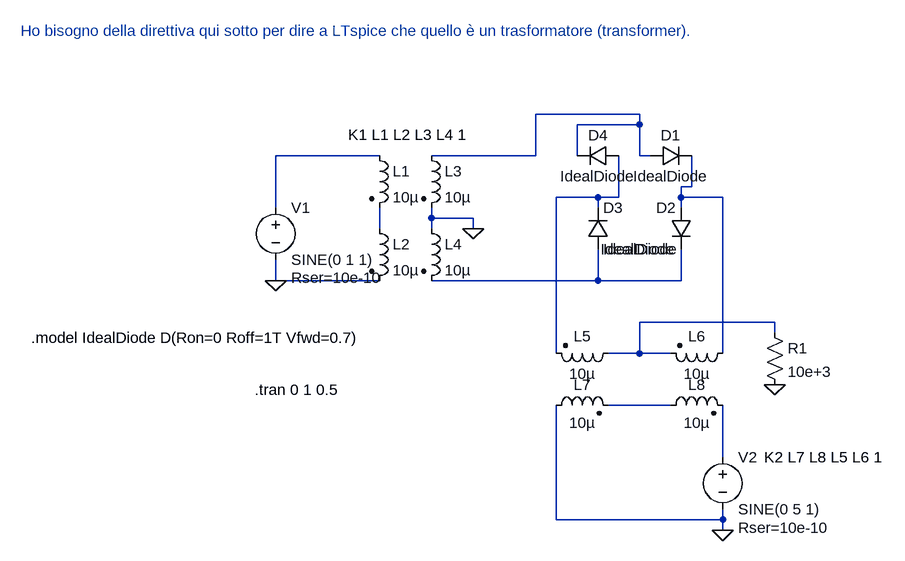
[diagram p0: schematic precision_rectifier - Copia.asc]
precision_rectifier - Copia.asc, the LTspice schematic file:
Version 4
SHEET 1 916 680
WIRE 528 -16 368 -16
WIRE 528 0 528 -16
WIRE 528 0 432 0
WIRE 128 48 -32 48
WIRE 368 48 368 -16
WIRE 368 48 208 48
WIRE 432 48 432 0
WIRE 528 48 528 0
WIRE 544 48 528 48
WIRE 608 96 608 48
WIRE 608 96 592 96
WIRE 464 112 400 112
WIRE 496 112 496 48
WIRE 496 112 464 112
WIRE 592 112 592 96
WIRE 656 112 592 112
WIRE -32 128 -32 48
WIRE 464 128 464 112
WIRE 592 128 592 112
WIRE 208 144 208 128
WIRE 272 144 208 144
WIRE 128 160 128 128
WIRE 208 160 208 144
WIRE 272 160 272 144
WIRE -32 240 -32 208
WIRE 128 240 -32 240
WIRE 464 240 464 192
WIRE 464 240 208 240
WIRE 592 240 592 192
WIRE 592 240 464 240
WIRE 736 304 528 304
WIRE 736 320 736 304
WIRE 400 352 400 112
WIRE 528 352 528 304
WIRE 528 352 480 352
WIRE 576 352 528 352
WIRE 656 352 656 112
WIRE 576 432 480 432
WIRE 656 512 656 432
WIRE 400 608 400 432
WIRE 656 608 656 592
WIRE 656 608 400 608
WIRE 656 624 656 608
FLAG 272 160 0
FLAG -32 240 0
FLAG 736 400 0
FLAG 656 624 0
SYMBOL voltage -32 112 R0
WINDOW 123 0 0 Left 0
WINDOW 39 24 124 Left 2
SYMATTR SpiceLine Rser=10e-10
SYMATTR InstName V1
SYMATTR Value SINE(0 1 1)
SYMBOL ind2 112 32 R0
SYMATTR InstName L1
SYMATTR Value 10µ
SYMATTR Type ind
SYMBOL ind2 112 144 R0
SYMATTR InstName L2
SYMATTR Value 10µ
SYMATTR Type ind
SYMBOL ind2 192 32 R0
SYMATTR InstName L3
SYMATTR Value 10µ
SYMATTR Type ind
SYMBOL ind2 192 144 R0
SYMATTR InstName L4
SYMATTR Value 10µ
SYMATTR Type ind
SYMBOL diode 544 32 M90
WINDOW 0 0 32 VBottom 2
WINDOW 3 32 32 VTop 2
SYMATTR InstName D1
SYMATTR Value IdealDiode
SYMBOL diode 608 128 M0
SYMATTR InstName D2
SYMATTR Value IdealDiode
SYMBOL diode 448 192 M180
WINDOW 0 24 64 Left 2
WINDOW 3 24 0 Left 2
SYMATTR InstName D3
SYMATTR Value IdealDiode
SYMBOL diode 496 64 M270
WINDOW 0 32 32 VTop 2
WINDOW 3 0 32 VBottom 2
SYMATTR InstName D4
SYMATTR Value IdealDiode
SYMBOL ind2 496 336 R90
WINDOW 0 5 56 VBottom 2
WINDOW 3 32 56 VTop 2
SYMATTR InstName L5
SYMATTR Value 10µ
SYMATTR Type ind
SYMBOL ind2 672 336 R90
WINDOW 0 5 56 VBottom 2
WINDOW 3 32 56 VTop 2
SYMATTR InstName L6
SYMATTR Value 10µ
SYMATTR Type ind
SYMBOL ind2 384 448 R270
WINDOW 0 32 56 VTop 2
WINDOW 3 5 56 VBottom 2
SYMATTR InstName L7
SYMATTR Value 10µ
SYMATTR Type ind
SYMBOL ind2 560 448 R270
WINDOW 0 32 56 VTop 2
WINDOW 3 5 56 VBottom 2
SYMATTR InstName L8
SYMATTR Value 10µ
SYMATTR Type ind
SYMBOL res 720 304 R0
SYMATTR InstName R1
SYMATTR Value 10e+3
SYMBOL voltage 656 496 R0
WINDOW 123 0 0 Left 0
WINDOW 39 24 124 Left 2
SYMATTR InstName V2
SYMATTR Value SINE(0 5 1)
SYMATTR SpiceLine Rser=10e-10
TEXT -64 408 Left 2 !.tran 0 1 0.5
TEXT -408 328 Left 2 !.model IdealDiode D(Ron=0 Roff=1T Vfwd=0.7)
TEXT 80 16 Left 2 !K1 L1 L2 L3 L4 1
TEXT -424 -144 Left 2 ;Ho bisogno della direttiva qui sotto per dire a LTspice che quello è un trasformatore (transformer).
TEXT 720 512 Left 2 !K2 L7 L8 L5 L6 1

The netlist it stands for:
* precision_rectifier - Copia.asc
V1 N002 0 SINE(0 1 1) Rser=10e-10
L1 N002 N005 10µ
L2 N005 0 10µ
L3 N001 0 10µ
L4 0 N006 10µ
D1 N001 N003 IdealDiode
D2 N003 N006 IdealDiode
D3 N006 N004 IdealDiode
D4 N004 N001 IdealDiode
L5 N007 N004 10µ
L6 N003 N007 10µ
L7 0 N008 10µ
L8 N008 N009 10µ
R1 N007 0 10e+3
V2 N009 0 SINE(0 5 1) Rser=10e-10
.model D D
.lib standard.dio
.tran 0 1 0.5
.model IdealDiode D(Ron=0 Roff=1T Vfwd=0.7)
K1 L1 L2 L3 L4 1
* Ho bisogno della direttiva qui sotto per dire a LTspice che quello è un trasformatore (transformer).
K2 L7 L8 L5 L6 1
.backanno
.end